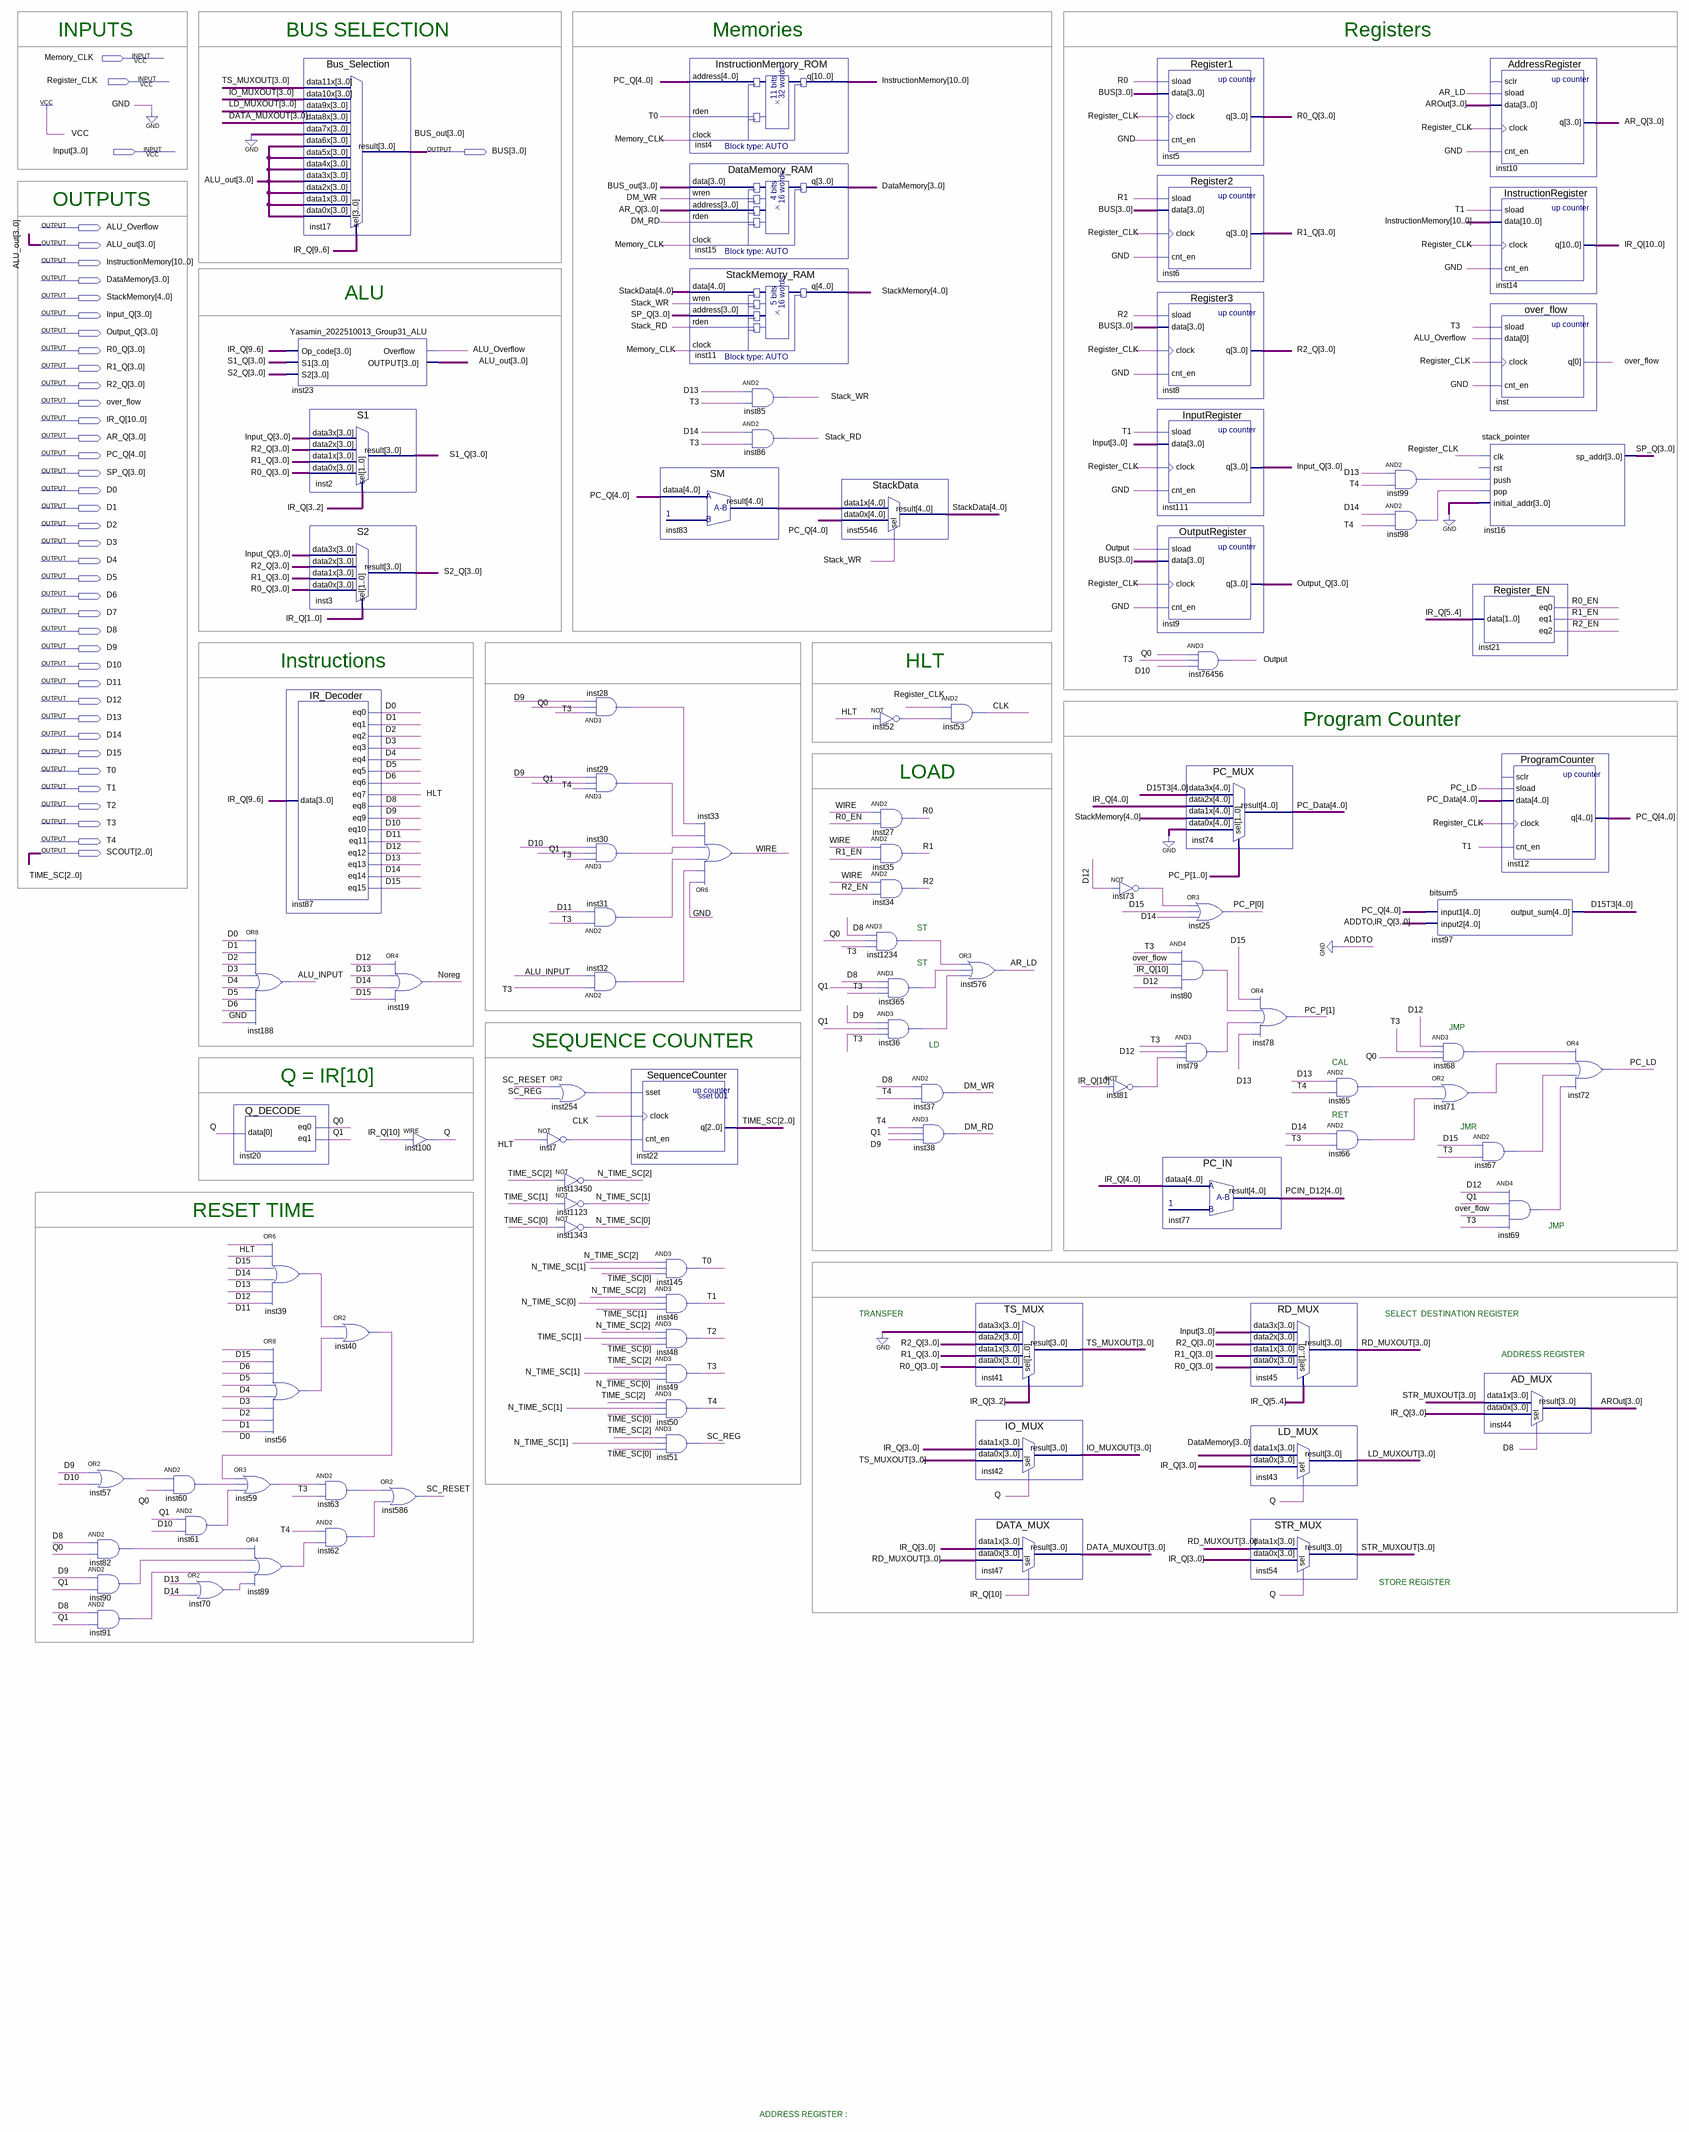
[diagram p0: schematic sheet]
// Quartus schematic Gulnaz_2020510121_Group31_ControlUnit.bdf as structural Verilog: 97 symbols, 41 pins
module Gulnaz_2020510121_Group31_ControlUnit (
  input  Memory_CLK,
  input  Register_CLK,
  input  [3:0] Input,
  output [3:0] BUS,
  output ALU_Overflow,
  output [3:0] ALU_out,
  output [10:0] InstructionMemory,
  output [3:0] DataMemory,
  output [4:0] StackMemory,
  output [3:0] Input_Q,
  output [3:0] Output_Q,
  output [3:0] R0_Q,
  output [3:0] R1_Q,
  output [3:0] R2_Q,
  output over_flow,
  output [10:0] IR_Q,
  output [3:0] AR_Q,
  output [4:0] PC_Q,
  output [3:0] SP_Q,
  output D0,
  output D1,
  output D2,
  output D3,
  output D4,
  output D5,
  output D6,
  output D7,
  output D8,
  output D9,
  output D10,
  output D11,
  output D12,
  output D13,
  output D14,
  output D15,
  output T0,
  output T1,
  output T2,
  output T3,
  output T4,
  output [2:0] SCOUT
);

  wire ALU_INPUT, AR_LD, CLK, DM_RD, DM_WR, HLT, inst7_out, inst28_out, inst29_out, inst30_out, inst31_out,
       inst32_out, inst36_out, inst39_out, inst40_out, inst52_out, inst56_out, inst57_out, inst59_out,
       inst60_out, inst61_out, inst62_out, inst63_out, inst65_out, inst66_out, inst67_out, inst68_out,
       inst69_out, inst70_out, inst71_out, inst73_out, inst79_out, inst80_out, inst81_out, inst82_out,
       inst89_out, inst90_out, inst91_out, inst98_out, inst99_out, inst254_out, inst365_out, inst1234_out,
       Noreg, Output, PC_LD, Q, Q0, Q1, R0, R0_EN, R1, R1_EN, R2, R2_EN, SC_REG, SC_RESET, Stack_RD,
       Stack_WR, WIRE;
  wire [1:0] PC_P;
  wire [2:0] N_TIME_SC;
  wire [3:0] AROut, DATA_MUXOUT, IO_MUXOUT, LD_MUXOUT, RD_MUXOUT, S1_Q, S2_Q, STR_MUXOUT, TS_MUXOUT;
  wire [4:0] D15T3, inst83_result, PC_Data, PCIN_D12, StackData;

  or inst57 (inst57_out, D9, D10);
  and inst82 (inst82_out, D8, Q0);
  and inst90 (inst90_out, D9, Q1);
  and inst91 (inst91_out, D8, Q1);
  and inst60 (inst60_out, inst57_out, Q0);
  and inst61 (inst61_out, Q1, D10);
  or inst70 (inst70_out, D13, D14);
  or inst188 (ALU_INPUT, D0, D1, D2, D3, D4, D5, D6, 1'b0);
  Q_DECODE inst20 (.data(Q), .eq0(Q0), .eq1(Q1));
  or inst59 (inst59_out, inst40_out, inst60_out, inst61_out);
  or inst89 (inst89_out, inst82_out, inst90_out, inst91_out, inst70_out);
  Yasamin_2022510013_Group31_ALU inst23 (
    .Op_code(IR_Q[9:6]), .S1(S1_Q), .S2(S2_Q), .Overflow(ALU_Overflow), .OUTPUT(ALU_out));
  IR_Decoder inst87 (
    .data(IR_Q[9:6]), .eq0(D0), .eq1(D1), .eq2(D2), .eq3(D3), .eq4(D4), .eq5(D5), .eq6(D6), .eq7(HLT),
    .eq8(D8), .eq9(D9), .eq10(D10), .eq11(D11), .eq12(D12), .eq13(D13), .eq14(D14), .eq15(D15));
  or inst39 (inst39_out, HLT, D15, D14, D13, D12, D11);
  or inst56 (inst56_out, D15, D6, D5, D4, D3, D2, D1, D0);
  Bus_Selection inst17 (
    .data11x(TS_MUXOUT), .data10x(IO_MUXOUT), .data9x(LD_MUXOUT), .data8x(DATA_MUXOUT), .data7x(4'b0000),
    .data6x(ALU_out), .data5x(ALU_out), .data4x(ALU_out), .data3x(ALU_out), .data2x(ALU_out),
    .data1x(ALU_out), .data0x(ALU_out), .sel(IR_Q[9:6]), .result(BUS));
  S1 inst2 (.data3x(Input_Q), .data2x(R2_Q), .data1x(R1_Q), .data0x(R0_Q), .sel(IR_Q[3:2]), .result(S1_Q));
  S2 inst3 (.data3x(Input_Q), .data2x(R2_Q), .data1x(R1_Q), .data0x(R0_Q), .sel(IR_Q[1:0]), .result(S2_Q));
  or inst40 (inst40_out, inst39_out, inst56_out);
  and inst63 (inst63_out, inst59_out, T3);
  and inst62 (inst62_out, T4, inst89_out);
  or inst19 (Noreg, D12, D13, D14, D15);
  or inst586 (SC_RESET, inst63_out, inst62_out);
  assign Q = IR_Q[10];  // WIRE inst100
  or inst254 (inst254_out, SC_RESET, SC_REG);
  not inst7 (inst7_out, HLT);
  not inst13450 (N_TIME_SC[2], SCOUT[2]);
  not inst1123 (N_TIME_SC[1], SCOUT[1]);
  not inst1343 (N_TIME_SC[0], SCOUT[0]);
  and inst28 (inst28_out, T3, Q0, D9);
  and inst29 (inst29_out, T4, Q1, D9);
  and inst30 (inst30_out, T3, Q1, D10);
  and inst31 (inst31_out, T3, D11);
  and inst32 (inst32_out, T3, ALU_INPUT);
  SM inst83 (.dataa(PC_Q), .result(inst83_result));
  SequenceCounter inst22 (.sset(inst254_out), .clock(CLK), .cnt_en(inst7_out), .q(SCOUT));
  and inst145 (T0, N_TIME_SC[2], N_TIME_SC[1], SCOUT[0]);
  and inst46 (T1, N_TIME_SC[2], N_TIME_SC[0], SCOUT[1]);
  and inst48 (T2, N_TIME_SC[2], SCOUT[1], SCOUT[0]);
  and inst49 (T3, SCOUT[2], N_TIME_SC[1], N_TIME_SC[0]);
  and inst50 (T4, SCOUT[2], N_TIME_SC[1], SCOUT[0]);
  and inst51 (SC_REG, SCOUT[2], N_TIME_SC[1], SCOUT[0]);
  InstructionMemory_ROM inst4 (.address(PC_Q), .rden(T0), .clock(Memory_CLK), .q(InstructionMemory));
  DataMemory_RAM inst15 (.data(BUS), .wren(DM_WR), .address(AR_Q), .rden(DM_RD), .clock(Memory_CLK), .q(DataMemory));
  StackMemory_RAM inst11 (
    .data(StackData), .wren(Stack_WR), .address(SP_Q), .rden(Stack_RD), .clock(Memory_CLK), .q(StackMemory));
  or inst33 (WIRE, 1'b0, inst32_out, inst31_out, inst30_out, inst29_out, inst28_out);
  and inst85 (Stack_WR, D13, T3);
  and inst86 (Stack_RD, D14, T3);
  StackData inst5546 (.data1x(inst83_result), .data0x(PC_Q), .sel(Stack_WR), .result(StackData));
  not inst52 (inst52_out, HLT);
  and inst27 (R0, WIRE, R0_EN);
  and inst35 (R1, WIRE, R1_EN);
  and inst34 (R2, WIRE, R2_EN);
  and inst1234 (inst1234_out, D8, Q0, T3);
  and inst365 (inst365_out, D8, Q1, T3);
  and inst36 (inst36_out, D9, Q1, T3);
  and inst53 (CLK, Register_CLK, inst52_out);
  and inst37 (DM_WR, D8, T4);
  and inst38 (DM_RD, T4, Q1, D9);
  or inst576 (AR_LD, inst1234_out, inst365_out, inst36_out);
  TS_MUX inst41 (.data3x(4'b0000), .data2x(R2_Q), .data1x(R1_Q), .data0x(R0_Q), .sel(IR_Q[3:2]), .result(TS_MUXOUT));
  IO_MUX inst42 (.data1x(IR_Q[3:0]), .data0x(TS_MUXOUT), .sel(Q), .result(IO_MUXOUT));
  DATA_MUX inst47 (.data1x(IR_Q[3:0]), .data0x(RD_MUXOUT), .sel(IR_Q[10]), .result(DATA_MUXOUT));
  not inst73 (inst73_out, D12);
  not inst81 (inst81_out, IR_Q[10]);
  Register1 inst5 (.sload(R0), .data(BUS), .clock(Register_CLK), .cnt_en(1'b0), .q(R0_Q));
  Register2 inst6 (.sload(R1), .data(BUS), .clock(Register_CLK), .cnt_en(1'b0), .q(R1_Q));
  Register3 inst8 (.sload(R2), .data(BUS), .clock(Register_CLK), .cnt_en(1'b0), .q(R2_Q));
  InputRegister inst111 (.sload(T1), .data(Input), .clock(Register_CLK), .cnt_en(1'b0), .q(Input_Q));
  OutputRegister inst9 (.sload(Output), .data(BUS), .clock(Register_CLK), .cnt_en(1'b0), .q(Output_Q));
  and inst76456 (Output, Q0, T3, D10);
  PC_MUX inst74 (
    .data3x(D15T3), .data2x(IR_Q[4:0]), .data1x(StackMemory), .data0x({5{1'b0}}), .sel(PC_P), .result(PC_Data));
  or inst25 (PC_P[0], inst73_out, D15, D14);
  and inst80 (inst80_out, T3, over_flow, IR_Q[10], D12);
  and inst79 (inst79_out, T3, D12, inst81_out);
  PC_IN inst77 (.dataa(IR_Q[4:0]), .result(PCIN_D12));
  or inst78 (PC_P[1], D15, inst80_out, inst79_out, D13);
  RD_MUX inst45 (.data3x(Input), .data2x(R2_Q), .data1x(R1_Q), .data0x(R0_Q), .sel(IR_Q[5:4]), .result(RD_MUXOUT));
  LD_MUX inst43 (.data1x(DataMemory), .data0x(IR_Q[3:0]), .sel(Q), .result(LD_MUXOUT));
  STR_MUX inst54 (.data1x(RD_MUXOUT), .data0x(IR_Q[3:0]), .sel(Q), .result(STR_MUXOUT));
  and inst65 (inst65_out, D13, T4);
  and inst66 (inst66_out, D14, T3);
  and inst99 (inst99_out, D13, T4);
  and inst98 (inst98_out, D14, T4);
  bitsum5 inst97 (.input1(PC_Q), .input2({1'b0, IR_Q[3:0]}), .output_sum(D15T3));
  and inst68 (inst68_out, D12, T3, Q0);
  or inst71 (inst71_out, inst65_out, inst66_out);
  AddressRegister inst10 (.sload(AR_LD), .data(AROut), .clock(Register_CLK), .cnt_en(1'b0), .q(AR_Q));  // open: sclr
  InstructionRegister inst14 (.sload(T1), .data(InstructionMemory), .clock(Register_CLK), .cnt_en(1'b0), .q(IR_Q));
  over_flow inst (.sload(T3), .data(ALU_Overflow), .clock(Register_CLK), .cnt_en(1'b0), .q(over_flow));
  stack_pointer inst16 (
    .clk(Register_CLK), .push(inst99_out), .pop(inst98_out), .initial_addr(4'b0000), .sp_addr(SP_Q));  // open: rst
  Register_EN inst21 (.data(IR_Q[5:4]), .eq0(R0_EN), .eq1(R1_EN), .eq2(R2_EN));
  ProgramCounter inst12 (.sload(PC_LD), .data(PC_Data), .clock(Register_CLK), .cnt_en(T1), .q(PC_Q));  // open: sclr
  and inst67 (inst67_out, D15, T3);
  and inst69 (inst69_out, D12, Q1, over_flow, T3);
  AD_MUX inst44 (.data1x(STR_MUXOUT), .data0x(IR_Q[3:0]), .sel(D8), .result(AROut));
  or inst72 (PC_LD, inst68_out, inst71_out, inst67_out, inst69_out);

  // Other names for the same wires on the sheet: BUS_out[3:0] = BUS; TIME_SC[2:0] = SCOUT

  // Notes on the sheet:
  //   INPUTS
  //   BUS SELECTION
  //   Memories
  //   Registers
  //   OUTPUTS
  //   ALU
  //   Instructions
  //   HLT
  //   Program Counter
  //   LOAD
  //   ST
  //   ST
  //   JMP
  //   SEQUENCE COUNTER
  //   LD
  //   CAL
  //   Q = IR[10]
  //   RET
  //   JMR
  //   RESET TIME
  //   JMP
  //   TRANSFER
  //   SELECT  DESTINATION REGISTER
  //   ADDRESS REGISTER
  //   STORE REGISTER
  //   ADDRESS REGISTER :  
endmodule
